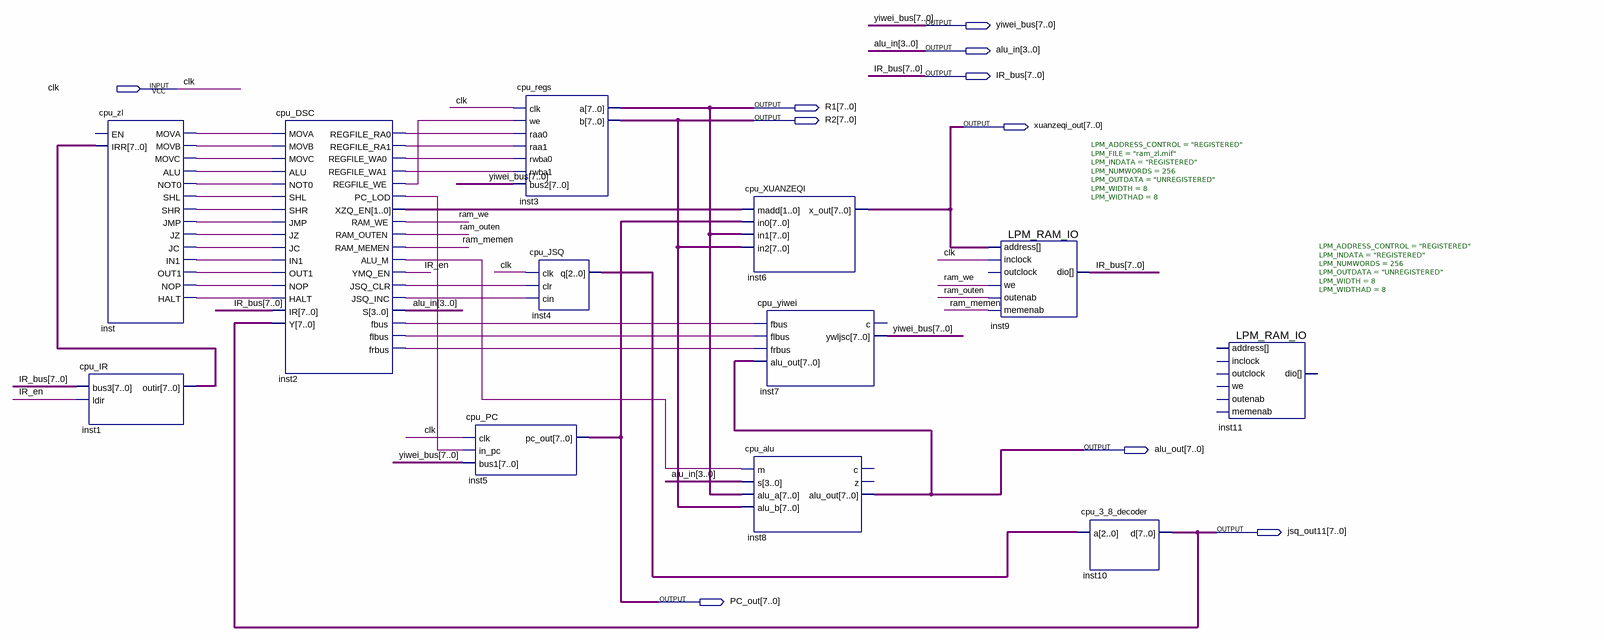
[diagram p0: schematic sheet]
// Quartus schematic cpu.bdf as structural Verilog: 12 symbols, 10 pins
module cpu (
  input  clk,
  output [7:0] yiwei_bus,
  output [3:0] alu_in,
  output [7:0] IR_bus,
  output [7:0] R1,
  output [7:0] R2,
  output [7:0] xuanzeqi_out,
  output [7:0] alu_out,
  output [7:0] jsq_out11,
  output [7:0] PC_out
);

  wire inst2_alu_m, inst2_fbus, inst2_flbus, inst2_frbus, inst2_jsq_clr, inst2_jsq_inc, inst2_pc_lod,
       inst2_regfile_ra0, inst2_regfile_ra1, inst2_regfile_wa0, inst2_regfile_wa1, inst2_regfile_we,
       inst_alu, inst_halt, inst_in1, inst_jc, inst_jmp, inst_jz, inst_mova, inst_movb, inst_movc, inst_nop,
       inst_not0, inst_out1, inst_shl, inst_shr, IR_en, ram_memen, ram_outen, ram_we;
  wire [1:0] inst2_xzq_en;
  wire [2:0] inst4_q;
  wire [7:0] inst1_outir;

  cpu_IR inst1 (.bus3(IR_bus), .ldir(IR_en), .outir(inst1_outir));
  cpu_zl inst (
    .IRR(inst1_outir), .MOVA(inst_mova), .MOVB(inst_movb), .MOVC(inst_movc), .ALU(inst_alu),
    .NOT0(inst_not0), .SHL(inst_shl), .SHR(inst_shr), .JMP(inst_jmp), .JZ(inst_jz), .JC(inst_jc),
    .IN1(inst_in1), .OUT1(inst_out1), .NOP(inst_nop), .HALT(inst_halt));  // open: EN
  cpu_DSC inst2 (
    .MOVA(inst_mova), .MOVB(inst_movb), .MOVC(inst_movc), .ALU(inst_alu), .NOT0(inst_not0), .SHL(inst_shl),
    .SHR(inst_shr), .JMP(inst_jmp), .JZ(inst_jz), .JC(inst_jc), .IN1(inst_in1), .OUT1(inst_out1),
    .NOP(inst_nop), .HALT(inst_halt), .IR(IR_bus), .Y(jsq_out11), .REGFILE_RA0(inst2_regfile_ra0),
    .REGFILE_RA1(inst2_regfile_ra1), .REGFILE_WA0(inst2_regfile_wa0), .REGFILE_WA1(inst2_regfile_wa1),
    .REGFILE_WE(inst2_regfile_we), .PC_LOD(inst2_pc_lod), .XZQ_EN(inst2_xzq_en), .RAM_WE(ram_we),
    .RAM_OUTEN(ram_outen), .RAM_MEMEN(ram_memen), .ALU_M(inst2_alu_m), .YMQ_EN(IR_en),
    .JSQ_CLR(inst2_jsq_clr), .JSQ_INC(inst2_jsq_inc), .S(alu_in), .fbus(inst2_fbus), .flbus(inst2_flbus),
    .frbus(inst2_frbus));
  cpu_PC inst5 (.clk(clk), .in_pc(inst2_pc_lod), .bus1(yiwei_bus), .pc_out(PC_out));
  cpu_regs inst3 (
    .clk(clk), .we(inst2_regfile_we), .raa0(inst2_regfile_ra0), .raa1(inst2_regfile_ra1),
    .rwba0(inst2_regfile_wa0), .rwba1(inst2_regfile_wa1), .bus2(yiwei_bus), .a(R1), .b(R2));
  cpu_JSQ inst4 (.clk(clk), .clr(inst2_jsq_clr), .cin(inst2_jsq_inc), .q(inst4_q));
  cpu_XUANZEQI inst6 (.madd(inst2_xzq_en), .in0(PC_out), .in1(R1), .in2(R2), .x_out(xuanzeqi_out));
  cpu_yiwei inst7 (
    .fbus(inst2_fbus), .flbus(inst2_flbus), .frbus(inst2_frbus), .alu_out(alu_out), .ywljsc(yiwei_bus));  // open: c
  cpu_alu inst8 (.m(inst2_alu_m), .s(alu_in), .alu_a(R1), .alu_b(R2), .alu_out(alu_out));  // open: c, z
  LPM_RAM_IO #(.LPM_ADDRESS_CONTROL("REGISTERED"), .LPM_FILE("ram_zl.mif"), .LPM_INDATA("REGISTERED"), .LPM_NUMWORDS(256), .LPM_OUTDATA("UNREGISTERED"), .LPM_WIDTH(8), .LPM_WIDTHAD(8)) inst9 (
    .address(xuanzeqi_out), .memenab(ram_memen), .inclock(clk), .we(ram_we), .outenab(ram_outen), .dio(IR_bus));  // open: outclock
  cpu_3_8_decoder inst10 (.a(inst4_q), .d(jsq_out11));
  LPM_RAM_IO #(.LPM_ADDRESS_CONTROL("REGISTERED"), .LPM_INDATA("REGISTERED"), .LPM_NUMWORDS(256), .LPM_OUTDATA("UNREGISTERED"), .LPM_WIDTH(8), .LPM_WIDTHAD(8)) inst11 ();  // open: address, outclock, memenab, inclock, we, outenab, dio
endmodule
